# Altium schematic sheet main_2020-11-10_20-37-14.schdoc
size 311 x 213 mm
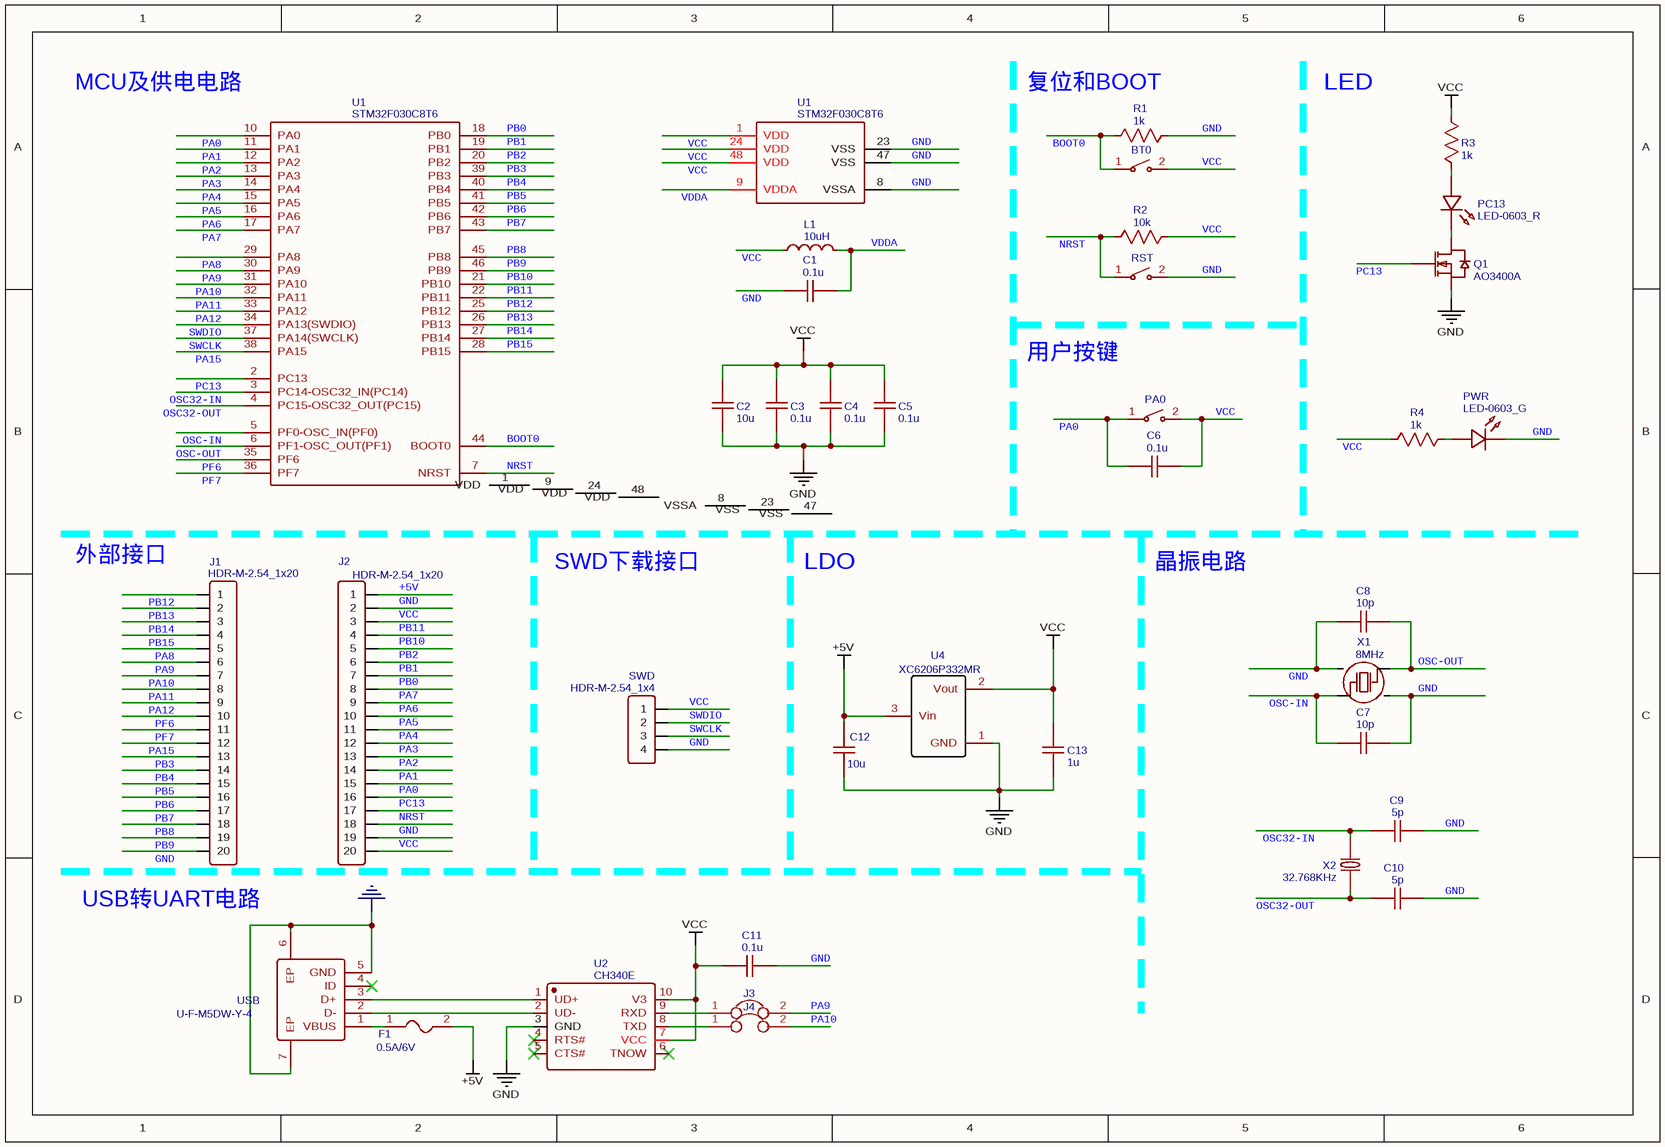
[diagram p0: main_2020-11-10_20-37-14.schdoc]

## Parts
(Parts that share a designator on the sheet are numbered #1, #2 ... from top to bottom, then left to right.)
BT0  TS-1088R-02026  [SW-SMD_L3.9-W3.0-P4.45]  (value not drawn)
C1  0.1u  [C0402]
C2  10u  [C0805]
C3  0.1u  [C0402]
C4  0.1u  [C0402]
C5  0.1u  [C0402]
C6  0.1u  [C0402]
C7  10p  [C0402]
C8  10p  [C0402]
C9  5p  [C0402]
C10  5p  [C0402]
C11  0.1u  [C0402]
C12  10u  [1206]
C13  1u  [C0603]
F1  0.5A/6V  [0805]
J1  HDR-M-2.54_1x20  [HDR-M-2.54_1X20]
J2  HDR-M-2.54_1x20  [HDR-M-2.54_1X20]
J3  JUMPER  [JUMPER-0603]  (value not drawn)
J4  JUMPER  [JUMPER-0603]  (value not drawn)
L1  10uH  [L0805]
PA0  TS-1088R-02026  [SW-SMD_L3.9-W3.0-P4.45]  (value not drawn)
PC13  LED-0603_R  [LED0603_RED]
PWR  LED-0603_G  [LED0603_GREEN]
Q1  AO3400A  [SOT-23-3_L2.9-W1.6-P1.90-LS2.8-BR]
R1  1k  [R0402]
R2  10k  [R0402]
R3  1k  [R0402]
R4  1k  [R0402]
RST  TS-1088R-02026  [SW-SMD_L3.9-W3.0-P4.45]  (value not drawn)
SWD  HDR-M-2.54_1x4  [HDR-M-2.54_1X4]
U1#1  STM32F030C8T6  [LQFP-48_L7.0-W7.0-P0.50-LS9.0-BL]
U1#2  STM32F030C8T6  [LQFP-48_L7.0-W7.0-P0.50-LS9.0-BL]
U2  CH340E  [MSOP-10_L3.0-W3.0-P0.50-LS5.0-BL]
U4  XC6206P332MR  [SOT-23(SOT-23-3)]
USB  U-F-M5DW-Y-4  [MICRO-USB-A12]
X1  8MHz  [OSC-SMD_4P-L3.2-W2.5-BL]
X2  32.768KHz  [OSC-SMD_L3.2-W1.5]

## Nets
+5V: C12.2 F1.2 J2.1 U4.3(Vin)
GND: C1.2 C2.1 C3.1 C4.1 C5.1 C7.2 C8.1 C9.1 C10.1 C11.1 C12.1 C13.1 J1.20 J2.2 J2.19 PWR.2 Q1.2(S) R1.2 RST.2 SWD.4 U1#1.8(VSSA) U1#1.23(VSS) U1#1.47(VSS) U2.3(GND) U4.1(GND) USB.5(GND) USB.6(EP) USB.7(EP) X1.2 X1.4
VCC: BT0.2 C2.2 C3.2 C4.2 C5.2 C6.1 C11.2 C13.2 J2.3 J2.20 L1.1 PA0.2 R2.2 R3.2 R4.2 SWD.1 U1#1.1(VDD) U1#1.24(VDD) U1#1.48(VDD) U2.7(VCC) U2.10(V3) U4.2(Vout)
BOOT0: BT0.1 R1.1 U1#2.44(BOOT0)
NRST: J2.18 R2.1 RST.1 U1#2.7(NRST)
OSC32-IN: C9.2 U1#2.3(PC14-OSC32_IN(PC14)) X2.2
OSC32-OUT: C10.2 U1#2.4(PC15-OSC32_OUT(PC15)) X2.1
OSC-IN: C7.1 U1#2.5(PF0-OSC_IN(PF0)) X1.1
OSC-OUT: C8.2 U1#2.6(PF1-OSC_OUT(PF1)) X1.3
PA0: C6.2 J2.16 PA0.1 U1#2.10(PA0)
PA1: J2.15 U1#2.11(PA1)
PA2: J2.14 U1#2.12(PA2)
PA3: J2.13 U1#2.13(PA3)
PA4: J2.12 U1#2.14(PA4)
PA5: J2.11 U1#2.15(PA5)
PA6: J2.10 U1#2.16(PA6)
PA7: J2.9 U1#2.17(PA7)
PA8: J1.5 U1#2.29(PA8)
PA9: J1.6 J3.2 U1#2.30(PA9)
PA10: J1.7 J4.2 U1#2.31(PA10)
PA11: J1.8 U1#2.32(PA11)
PA12: J1.9 U1#2.33(PA12)
PA15: J1.12 U1#2.38(PA15)
PB0: J2.8 U1#2.18(PB0)
PB1: J2.7 U1#2.19(PB1)
PB2: J2.6 U1#2.20(PB2)
PB3: J1.13 U1#2.39(PB3)
PB4: J1.14 U1#2.40(PB4)
PB5: J1.15 U1#2.41(PB5)
PB6: J1.16 U1#2.42(PB6)
PB7: J1.17 U1#2.43(PB7)
PB8: J1.18 U1#2.45(PB8)
PB9: J1.19 U1#2.46(PB9)
PB10: J2.5 U1#2.21(PB10)
PB11: J2.4 U1#2.22(PB11)
PB12: J1.1 U1#2.25(PB12)
PB13: J1.2 U1#2.26(PB13)
PB14: J1.3 U1#2.27(PB14)
PB15: J1.4 U1#2.28(PB15)
PC13: J2.17 Q1.1(G) U1#2.2(PC13)
PF6: J1.10 U1#2.35(PF6)
PF7: J1.11 U1#2.36(PF7)
SWCLK: SWD.3 U1#2.37(PA14(SWCLK))
SWDIO: SWD.2 U1#2.34(PA13(SWDIO))
VDDA: C1.1 L1.2 U1#1.9(VDDA)
NetF1_1: F1.1 USB.1(VBUS)
NetJ3_1: J3.1 U2.9(RXD)
NetJ4_1: J4.1 U2.8(TXD)
NetPC13_1: PC13.1 R3.1
NetPC13_2: PC13.2 Q1.3(D)
NetPWR_1: PWR.1 R4.1
NetU2_1: U2.1(UD+) USB.3(D+)
NetU2_2: U2.2(UD-) USB.2(D-)

Not connected (* = marked no-connect by the designer): U1#2 1(VDD) 8(VSSA) 9(VDD) 23(VSS) 24(VDD) 47(VSS) 48(VDD); U2 4(RTS#)* 5(CTS#)* 6(TNOW)*; USB 4(ID)*

## Notes on the sheet
- MCU及供电电路
- (near R1) 复位和BOOT
- LED
- 用户按键
- 外部接口
- (near U1#2) SWD下载接口
- (near U1#2) LDO
- 晶振电路
- (near J1) USB转UART电路

## Library data of the parts
BT0 PA0 RST = TS-1088R-02026: BOM_Manufacturer: XUNPU; Contributor: LCSC; BOM_Supplier: LCSC; BOM_Supplier Part: C455280; BOM_Manufacturer Part: TS-1088R-02026; spicePre: S; spiceSymbolName: TS-1088R-02026
C1 C3-C6 = 0.1u: nameAlias: Value(F); Contributor: LCEDA_Lib; spicePre: C; spiceSymbolName: C_0402_US
C2 = 10u: nameAlias: Value(F); Contributor: LCEDA_Lib; spicePre: C; spiceSymbolName: C_0805_US
C7 C8 = 10p: nameAlias: Value(F); Contributor: LCEDA_Lib; spicePre: C; spiceSymbolName: C_0402_US
C9 C10 = 5p: nameAlias: Value(F); Contributor: LCEDA_Lib; spicePre: C; spiceSymbolName: C_0402_US
C11 = 0.1u: nameAlias: Value(F); spicePre: C; spiceSymbolName: Cap_0805_US
C12 = 10u: nameAlias: Value(F); spicePre: C; spiceSymbolName: Cap_0805_US
C13 = 1u: nameAlias: Value(F); spicePre: C; spiceSymbolName: Cap_RAD-0.1_US
F1 = 0.5A/6V: BOM_Manufacturer: Yenji; BOM_Manufacturer Part: SMD0805P050TF; Contributor: LCSC; BOM_Supplier: LCSC; BOM_Supplier Part: C130286; spicePre: F
J1 J2 = HDR-M-2.54_1x20: Contributor: LCEDA_Lib; BOM_Supplier Part: C50981; BOM_Supplier: LCSC; spicePre: J; spiceSymbolName: HDR-M-2.54_1x20
L1 = 10uH: BOM_Manufacturer: microgate; BOM_Manufacturer Part: MGFI2012D100KT-LF; nameAlias: Inductance; Contributor: LCSC; BOM_Supplier: LCSC; BOM_Supplier Part: C281097; spicePre: L; spiceSymbolName: MGFI2012D100KT-LF
PC13 = LED-0603_R: BOM_Manufacturer: EVERLIGHT(台湾亿光); BOM_Manufacturer Part: 19-217/R6C-AL1M2VY/3T; Contributor: LCEDA_01; BOM_Supplier Part: C72044; BOM_Supplier: LCSC; spicePre: L; spiceSymbolName: LED-0603_R
PWR = LED-0603_G: BOM_Manufacturer: EVERLIGHT(台湾亿光); BOM_Manufacturer Part: 19-217/GHC-YR1S2/3T; Contributor: LCEDA_Lib; BOM_Supplier Part: C72043; BOM_Supplier: LCSC; spicePre: L; spiceSymbolName: LED-0603_G
Q1 = AO3400A: BOM_Manufacturer: AOS; SMT Type: Basic; BOM_Supplier: LCSC; BOM_Manufacturer Part: AO3400A; BOM_LCSC Assembly: Yes; image: //image.lceda.cn/szlcsc/C20917.jpg; BOM_Supplier Part: C20917; spicePre: Q; spiceSymbolName: AO3400A
R1 R3 R4 = 1k: nameAlias: Value(Ω); Contributor: LCEDA_Lib; spicePre: R; spiceSymbolName: R_0402_US
R2 = 10k: nameAlias: Value(Ω); Contributor: LCEDA_Lib; spicePre: R; spiceSymbolName: R_0402_US
SWD = HDR-M-2.54_1x4: Contributor: LCEDA_Lib; BOM_Supplier Part: C124378; BOM_Supplier: LCSC; spicePre: J; spiceSymbolName: HDR-M-2.54_1x4
U1#1 U1#2 = STM32F030C8T6: BOM_Manufacturer: ST; subpart_no: 1; tags: STM32; BOM_Supplier Part: C23922; BOM_Supplier: LCSC; BOM_Manufacturer Part: STM32F030C8T6; image: http://image.lceda.cn/szlcsc/C23922.jpg; spicePre: U; spiceSymbolName: STM32F030C8T6
U2 = CH340E: BOM_Manufacturer: WCH; SMT Type: Extend; BOM_Supplier: LCSC; BOM_Manufacturer Part: CH340E; BOM_Supplier Part: C99652; BOM_LCSC Assembly: Yes; spicePre: U; spiceSymbolName: CH340E
U4 = XC6206P332MR: BOM_Manufacturer: TOREX; SMT Type: Basic; BOM_Supplier: LCSC; BOM_Manufacturer Part: XC6206P332MR; BOM_LCSC Assembly: Yes; image: //image.lceda.cn/szlcsc/C5446.jpg; BOM_Supplier Part: C5446; spicePre: U
USB = U-F-M5DW-Y-4: BOM_Manufacturer: HRO; Contributor: LCSC; BOM_Supplier: LCSC; BOM_Manufacturer Part: U-F-M5DW-Y-4; BOM_Supplier Part: C145784; spicePre: U
X1 = 8MHz: BOM_Manufacturer: Zhejiang Abel Elec; BOM_Manufacturer Part: TAXM8M4RDBCCT2T; nameAlias: Frequency; Contributor: LCSC; SMT Type: Extend; BOM_Supplier: LCSC; BOM_Supplier Part: C400090; BOM_LCSC Assembly: Yes; spicePre: X; spiceSymbolName: TAXM8M4RDBCCT2T
X2 = 32.768KHz: BOM_Manufacturer: EPSON; BOM_Manufacturer Part: Q13FC1350004900; nameAlias: Frequency; BOM_Supplier: LCSC; BOM_Supplier Part: C95361; spicePre: X; spiceSymbolName: Q13FC1350004900
J3 J4 = JUMPER: spicePre: J; spiceSymbolName: JUMPER